# Altium schematic sheet FPGA-2.SchDoc
size A3; Date: Date; CompanyName: HESSO; Engineer: Name; Address1: Route du Rawyl 47; Address2: 1950 Sion; Address3: Switzerland; ProjectName: Project Name
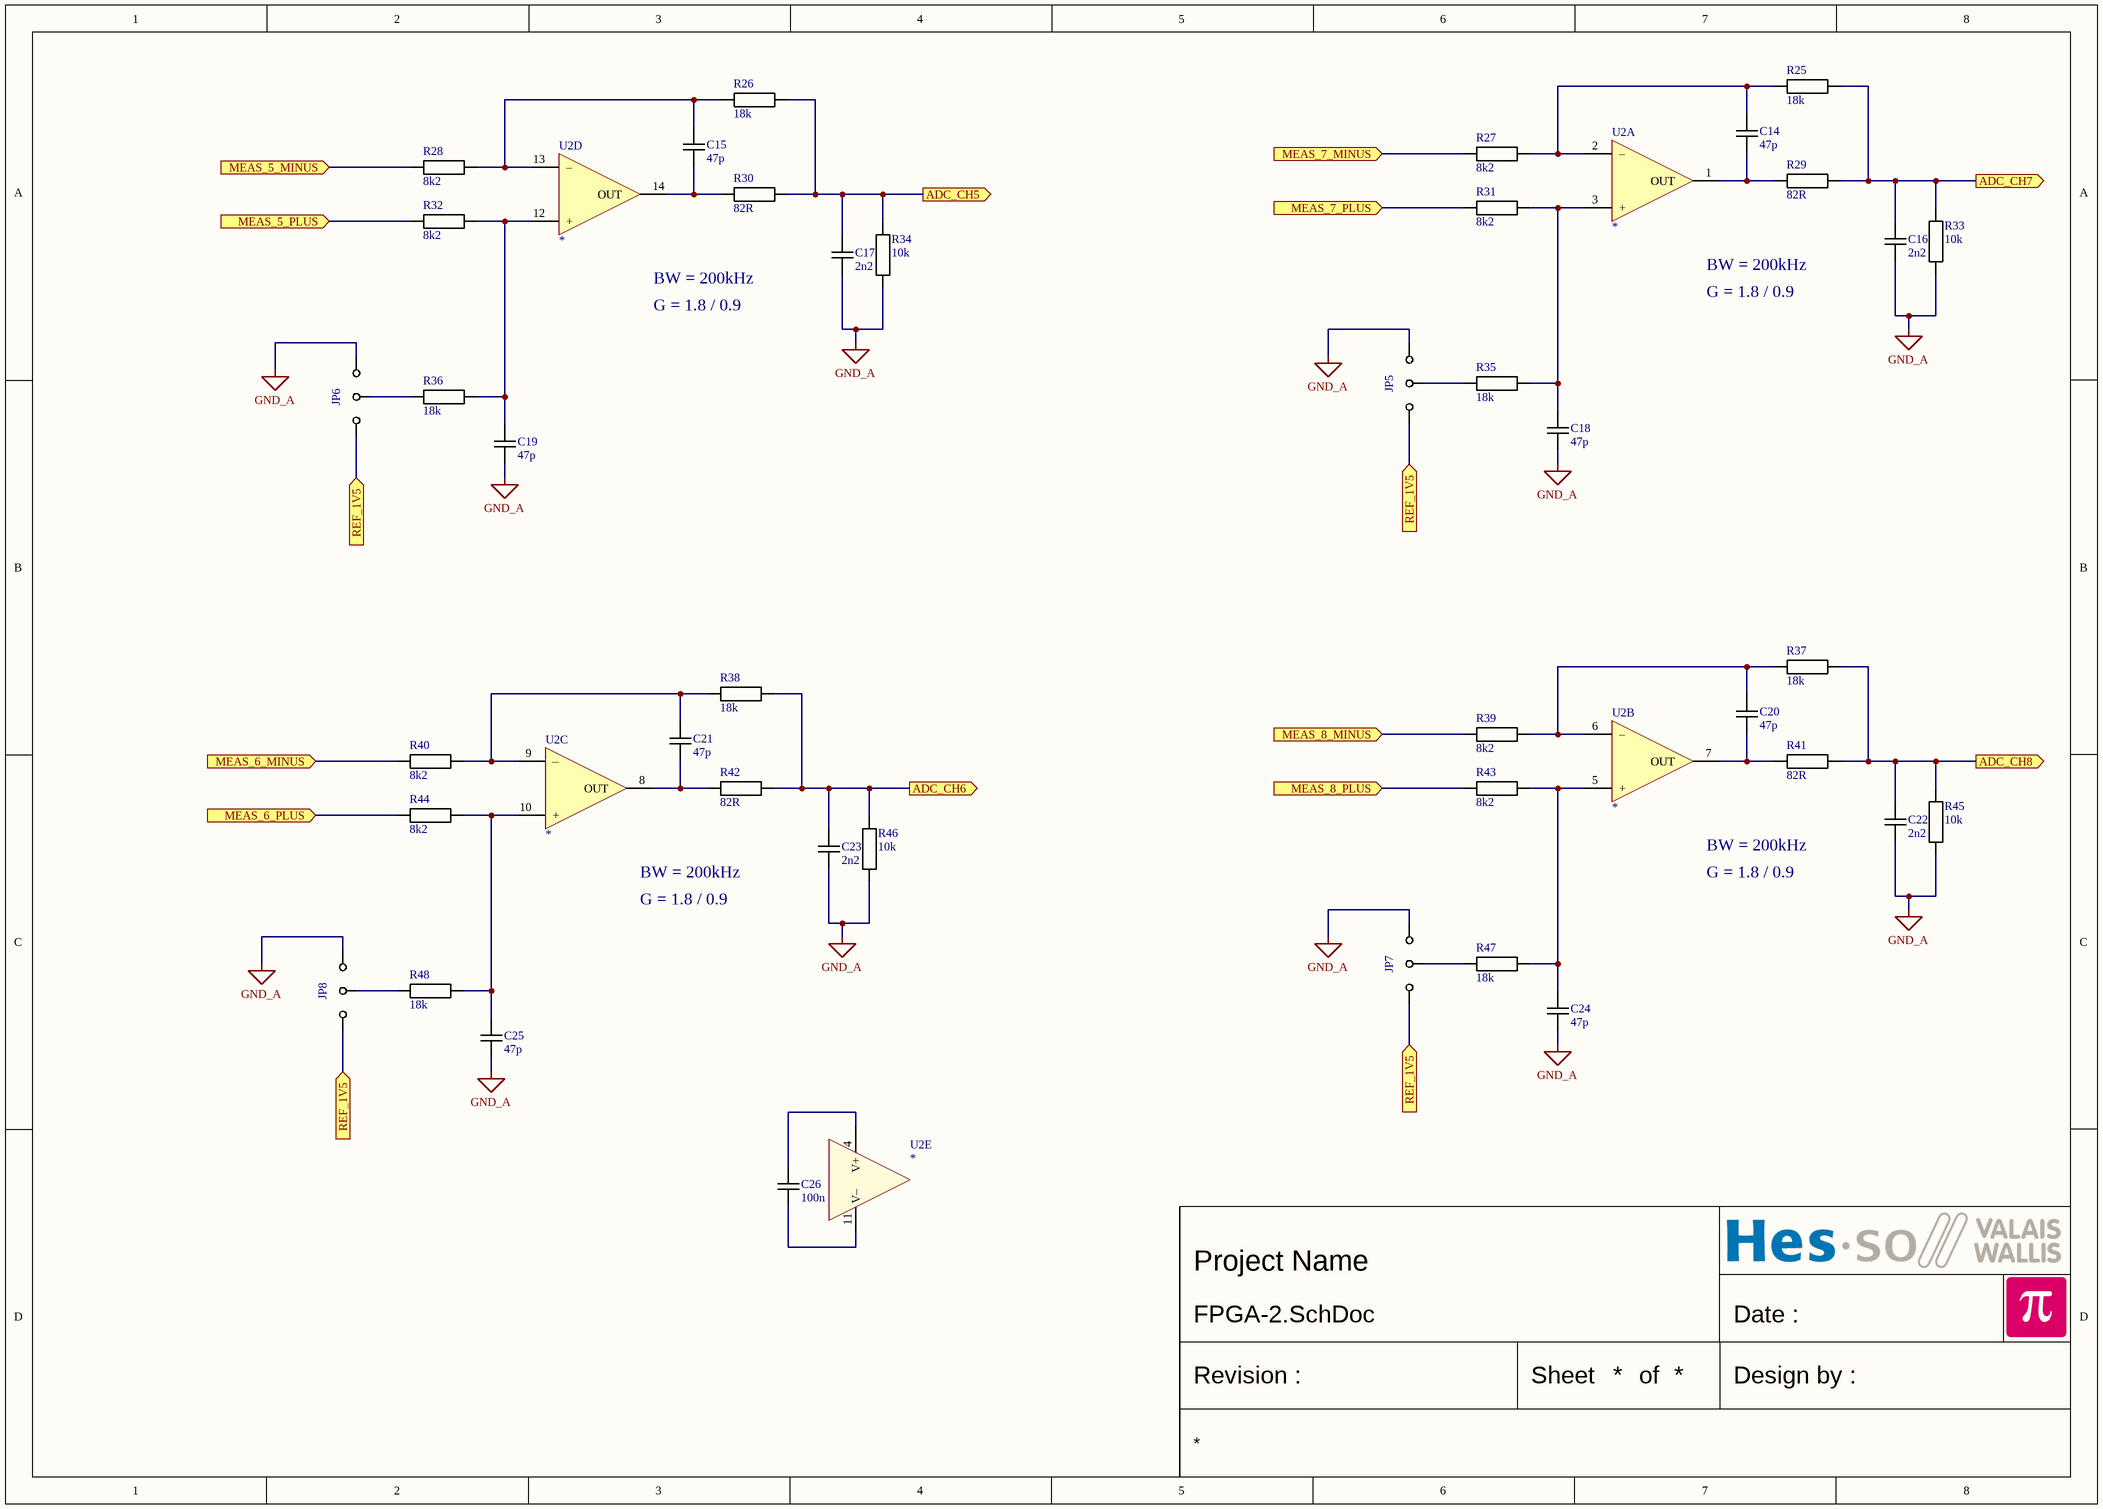
[diagram p0: FPGA-2.SchDoc]

## Parts
C14  47p  [CAPACITOR 1608 REFLOW]
C15  47p  [CAPACITOR 1608 REFLOW]
C16  2n2  [CAPACITOR 1608 REFLOW]
C17  2n2  [CAPACITOR 1608 REFLOW]
C18  47p  [CAPACITOR 1608 REFLOW]
C19  47p  [CAPACITOR 1608 REFLOW]
C20  47p  [CAPACITOR 1608 REFLOW]
C21  47p  [CAPACITOR 1608 REFLOW]
C22  2n2  [CAPACITOR 1608 REFLOW]
C23  2n2  [CAPACITOR 1608 REFLOW]
C24  47p  [CAPACITOR 1608 REFLOW]
C25  47p  [CAPACITOR 1608 REFLOW]
C26  100n  [CAPACITOR 1608 REFLOW]
JP5  {Value}  [JUMPER3 SMD 1608]  (value not drawn)
JP6  {Value}  [JUMPER3 SMD 1608]  (value not drawn)
JP7  {Value}  [JUMPER3 SMD 1608]  (value not drawn)
JP8  {Value}  [JUMPER3 SMD 1608]  (value not drawn)
R25  18k  [RESISTOR 1608 REFLOW]
R26  18k  [RESISTOR 1608 REFLOW]
R27  8k2  [RESISTOR 1608 REFLOW]
R28  8k2  [RESISTOR 1608 REFLOW]
R29  82R  [RESISTOR 1608 REFLOW]
R30  82R  [RESISTOR 1608 REFLOW]
R31  8k2  [RESISTOR 1608 REFLOW]
R32  8k2  [RESISTOR 1608 REFLOW]
R33  10k  [RESISTOR 1608 REFLOW]
R34  10k  [RESISTOR 1608 REFLOW]
R35  18k  [RESISTOR 1608 REFLOW]
R36  18k  [RESISTOR 1608 REFLOW]
R37  18k  [RESISTOR 1608 REFLOW]
R38  18k  [RESISTOR 1608 REFLOW]
R39  8k2  [RESISTOR 1608 REFLOW]
R40  8k2  [RESISTOR 1608 REFLOW]
R41  82R  [RESISTOR 1608 REFLOW]
R42  82R  [RESISTOR 1608 REFLOW]
R43  8k2  [RESISTOR 1608 REFLOW]
R44  8k2  [RESISTOR 1608 REFLOW]
R45  10k  [RESISTOR 1608 REFLOW]
R46  10k  [RESISTOR 1608 REFLOW]
R47  18k  [RESISTOR 1608 REFLOW]
R48  18k  [RESISTOR 1608 REFLOW]
U2  *  [SO14 P1.27 C4.0X8.8 H1.75]  (parts A,B,C,D,E of 5)

## Ports
ADC_CH5 (out), ADC_CH6 (out), ADC_CH7 (out), ADC_CH8 (out), MEAS_5_MINUS (in), MEAS_5_PLUS (in), MEAS_6_MINUS (in), MEAS_6_PLUS (in), MEAS_7_MINUS (in), MEAS_7_PLUS (in), MEAS_8_MINUS (in), MEAS_8_PLUS (in), REF_1V5 (in)

## Nets
GND_A: C16.1 C17.1 C18.1 C19.1 C22.1 C23.1 C24.1 C25.1 JP5.3 JP6.3 JP7.3 JP8.3 R33.2 R34.2 R45.2 R46.2
ADC_CH5: C17.2 R26.2 R30.2 R34.1 ; port ADC_CH5
ADC_CH6: C23.2 R38.2 R42.2 R46.1 ; port ADC_CH6
ADC_CH7: C16.2 R25.2 R29.2 R33.1 ; port ADC_CH7
ADC_CH8: C22.2 R37.2 R41.2 R45.1 ; port ADC_CH8
MEAS_5_MINUS: R28.1 ; port MEAS_5_MINUS
MEAS_5_PLUS: R32.1 ; port MEAS_5_PLUS
MEAS_6_MINUS: R40.1 ; port MEAS_6_MINUS
MEAS_6_PLUS: R44.1 ; port MEAS_6_PLUS
MEAS_7_MINUS: R27.1 ; port MEAS_7_MINUS
MEAS_7_PLUS: R31.1 ; port MEAS_7_PLUS
MEAS_8_MINUS: R39.1 ; port MEAS_8_MINUS
MEAS_8_PLUS: R43.1 ; port MEAS_8_PLUS
REF_1V5: JP5.1 JP6.1 JP7.1 JP8.1 ; port REF_1V5
NetC14_1: C14.1 R29.1 U2.1(OUT)
NetC14_2: C14.2 R25.1 R27.2 U2.2(–)
NetC15_1: C15.1 R30.1 U2.14(OUT)
NetC15_2: C15.2 R26.1 R28.2 U2.13(–)
NetC18_2: C18.2 R31.2 R35.1 U2.3(+)
NetC19_2: C19.2 R32.2 R36.1 U2.12(+)
NetC20_1: C20.1 R41.1 U2.7(OUT)
NetC20_2: C20.2 R37.1 R39.2 U2.6(–)
NetC21_1: C21.1 R42.1 U2.8(OUT)
NetC21_2: C21.2 R38.1 R40.2 U2.9(–)
NetC24_2: C24.2 R43.2 R47.1 U2.5(+)
NetC25_2: C25.2 R44.2 R48.1 U2.10(+)
NetC26_1: C26.1 U2.11(V–)
NetC26_2: C26.2 U2.4(V+)
NetJP5_2: JP5.2 R35.2
NetJP6_2: JP6.2 R36.2
NetJP7_2: JP7.2 R47.2
NetJP8_2: JP8.2 R48.2

## Notes on the sheet
- BW = 200kHz
- G = 1.8 / 0.9
- Date :
- Revision :
- Sheet
- of
- Design by :

## Library data of the parts
C14-C26 = Capacitor: Capacitor X7R 10% 50V 1608(0603)
  C14 C15 C18-C21 C24 C25: Value: 47p
  C16 C17 C22 C23: Value: 2n2
  C26: Value: 100n
JP5-JP8 = JUMPER 3 POS: Value: {Value}
R25-R48 = Resistor: Resistor 1% 50V 100mW 1608(0603)
  R25 R26 R35-R38 R47 R48: Value: 18k
  R27 R28 R31 R32 R39 R40 R43 R44: Value: 8k2
  R29 R30 R41 R42: Value: 82R
  R33 R34 R45 R46: Value: 10k
U2 = OPA QUAD: Generic quad OPA 14 pins; Value: *